# Altium schematic sheet digital_input_protection.SchDoc
size A
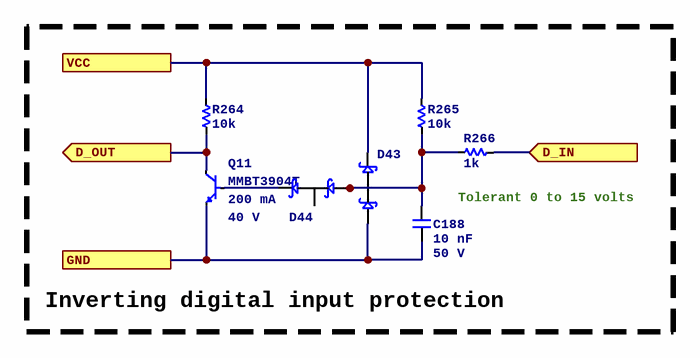
[diagram p0: digital_input_protection.SchDoc]

## Parts
C188  Capacitance: 10 nF  Voltage Rating: 50 V  [C0402]  (hidden comment: CL05B103KB5NNNC)
D43  BAT54SLT1G  [3SOT23]  (value not drawn)
D44  BAT54SLT1G  [3SOT23]  (value not drawn)
Q11  MMBT3904T  Current: 200 mA  Voltage: 40 V  [3SOT523]
R264  value 10k  [R0402]  (hidden comment: 0402WGF1002TCE)
R265  value 10k  [R0402]  (hidden comment: 0402WGF1002TCE)
R266  value 1k  [R0805]  (hidden comment: HP05W3F1001T5E)

## Ports
D_IN (in), D_OUT (out), GND, VCC

## Nets
D_IN: R266.1 ; port D_IN
D_OUT: Q11.3(C) R264.1 ; port D_OUT
GND: C188.2 D43.1 Q11.2(E) ; port GND
VCC: D43.2 R264.2 R265.2 ; port VCC
NetC188_1: C188.1 D43.3 D44.1 R265.1 R266.2
NetD44_2: D44.2 Q11.1(B)

Not connected (* = marked no-connect by the designer): D44 3

## Notes on the sheet
- Tolerant 0 to 15 volts
- Inverting digital input protection

## Library data of the parts
C188 = CL05B103KB5NNNC: Manufacturer: Samsung Electro-Mechanics; Dielectric: X7R; ComponentLink1URL: https://wmsc.lcsc.com/wmsc/upload/file/pdf/v2/lcsc/2304140030_Samsung-Electro-Mechanics-CL05B103KB5NNNC_C15195.pdf; ComponentLink1Description: Datasheet; Manufacturer Part Number: CL05B103KB5NNNC; Package: 0402; Supplier 2: LCSC; Supplier Part Number 2: C15195
D43 D44 = BAT54SLT1G: DIODE SCHOTTKY DUAL 30V SOT23; Manufacturer: ON Semiconductor; Current: 200 mA; Supplier 1: DigiKey; Manufacturer Part Number: BAT54SLT1G; ComponentLink1URL: https://www.onsemi.com/pdf/datasheet/bat54slt1-d.pdf; ComponentLink1Description: Datasheet; Supplier Part Number 1: BAT54SLT1GOSCT-ND; Supplier 2: LCSC; Supplier Part Number 2: C19726; Diode Type: Schottky; Vr: 30 V; Supplier 3: Mouser; Supplier Part Number 3: 863-BAT54SLT1G
Q11 = MMBT3904T: Bipolar (BJT) Transistor NPN 40 V 200 mA 300MHz 150 mW Surface Mount SOT-523; Manufacturer: Shenzhen Slkormicro Semicon Co., Ltd.; Supplier 1: DigiKey; Supplier Part Number 1: 5399-MMBT3904TCT-ND; Manufacturer Part Number: MMBT3904T; ComponentLink1Description: Datasheet; ComponentLink1URL: https://mm.digikey.com/Volume0/opasdata/d220001/medias/docus/7136/5399_MMBT3904T%20SOT-523.pdf; Supplier 2: LCSC; Supplier Part Number 2: C61616; Polarity: NPN
R264 R265 = 0402WGF1002TCE: Manufacturer: UNI-ROYAL(Uniroyal Elec); Tolerance: 1%; Temperature Coefficient: ±100ppm/?; Power Rating (mW): 62.5; ComponentLink1Description: Datasheet; ComponentLink1URL: https://wmsc.lcsc.com/wmsc/upload/file/pdf/v2/lcsc/2206010100_UNI-ROYAL-Uniroyal-Elec-0402WGF1002TCE_C25744.pdf; Manufacturer Part Number: 0402WGF1002TCE; Package: 0402; Supplier 2: LCSC; Supplier Part Number 2: C25744
R266 = HP05W3F1001T5E: Manufacturer: UNI-ROYAL(Uniroyal Elec); Tolerance: 1%; Temperature Coefficient: ±100ppm/?; Power Rating (mW): 333.3; ComponentLink1Description: Datasheet; ComponentLink1URL: https://datasheet.lcsc.com/lcsc/2304140030_UNI-ROYAL-Uniroyal-Elec-HP05W3F1001T5E_C2759346.pdf; Manufacturer Part Number: HP05W3F1001T5E; Package: 0805; Supplier 2: LCSC; Supplier Part Number 2: C2759346